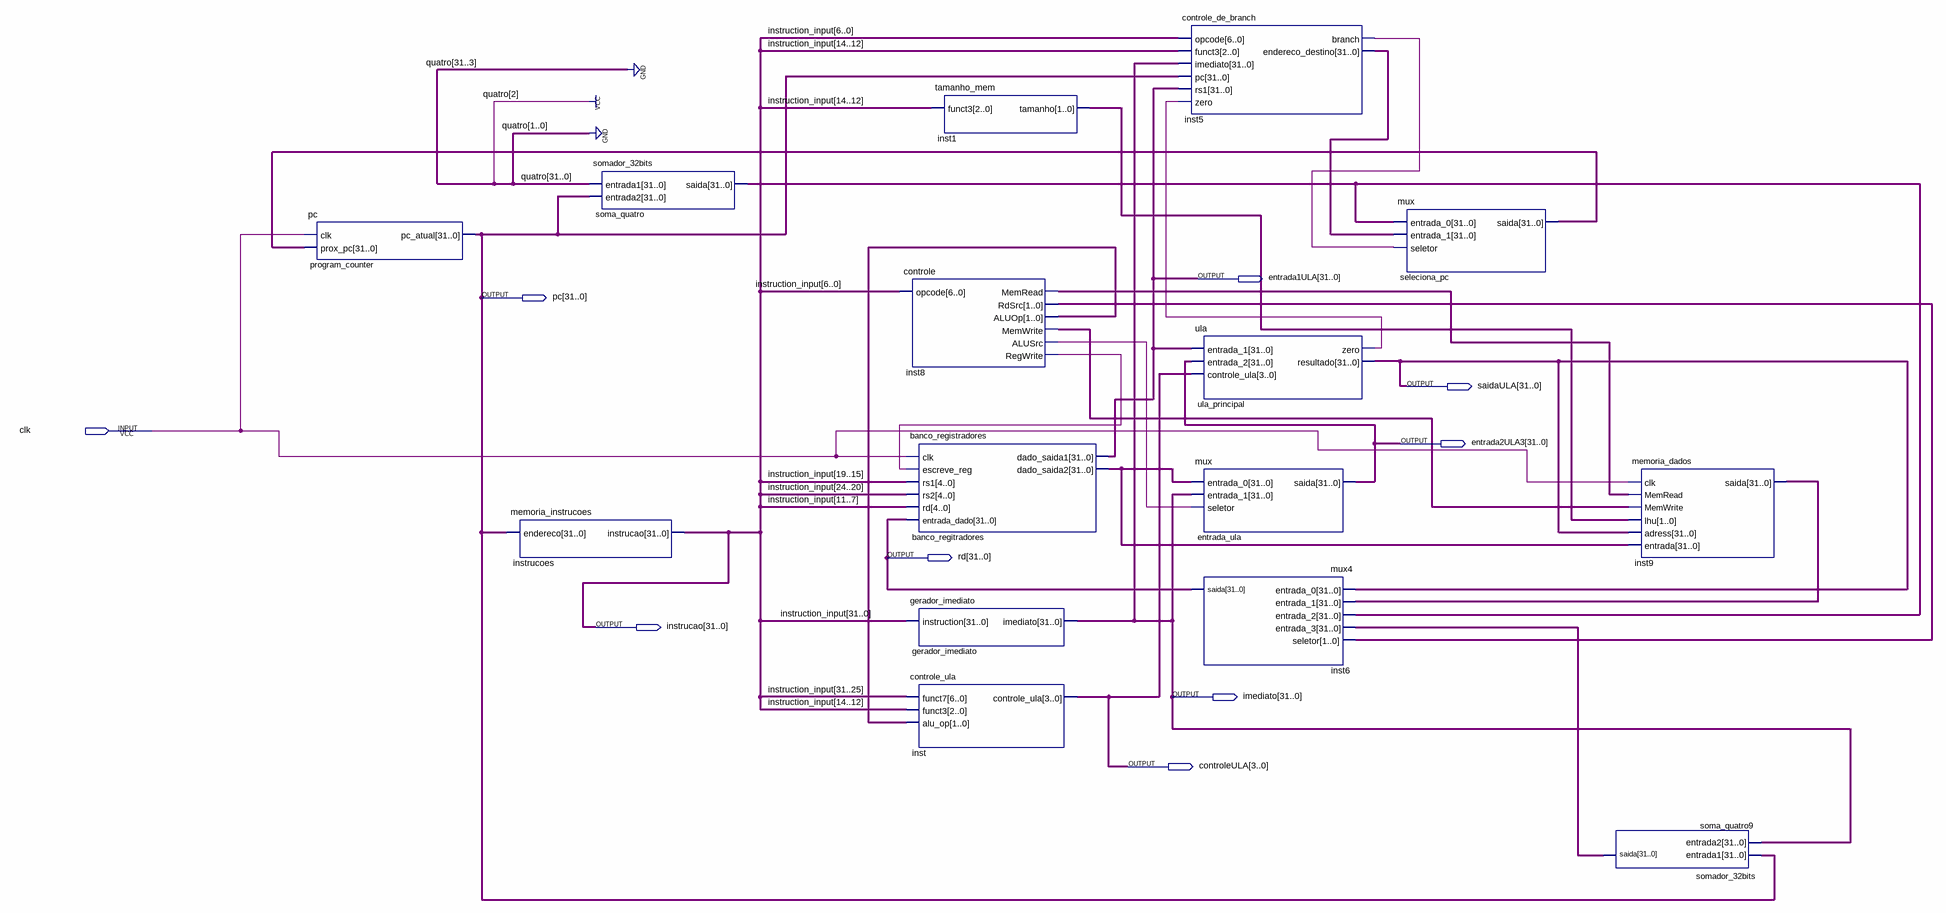
[diagram p0: schematic sheet]
// Quartus schematic lab2oac.bdf as structural Verilog: 15 symbols, 9 pins
module lab2oac (
  input  clk,
  output [31:0] entrada1ULA,
  output [31:0] pc,
  output [31:0] saidaULA,
  output [31:0] entrada2ULA3,
  output [31:0] rd,
  output [31:0] instrucao,
  output [31:0] imediato,
  output [3:0] controleULA
);

  wire inst5_branch, inst8_alusrc, inst8_memread, inst8_memwrite, inst8_regwrite, ula_principal_zero;
  wire [1:0] inst1_tamanho, inst8_aluop, inst8_rdsrc;
  wire [31:0] banco_regitradores_dado_saida2, inst5_endereco_destino, inst9_saida, seleciona_pc_saida,
       soma_quatro9_saida, soma_quatro_saida;

  pc program_counter (.clk(clk), .prox_pc(seleciona_pc_saida), .pc_atual(pc));
  memoria_instrucoes instrucoes (.endereco(pc), .instrucao(instrucao));
  somador_32bits soma_quatro (
    .entrada1(32'b00000000000000000000000000000100), .entrada2(pc), .saida(soma_quatro_saida));
  controle inst8 (
    .opcode(instrucao[6:0]), .MemRead(inst8_memread), .RdSrc(inst8_rdsrc), .ALUOp(inst8_aluop),
    .MemWrite(inst8_memwrite), .ALUSrc(inst8_alusrc), .RegWrite(inst8_regwrite));
  banco_registradores banco_regitradores (
    .clk(clk), .escreve_reg(inst8_regwrite), .rs1(instrucao[19:15]), .rs2(instrucao[24:20]),
    .rd(instrucao[11:7]), .entrada_dado(rd), .dado_saida1(entrada1ULA),
    .dado_saida2(banco_regitradores_dado_saida2));
  gerador_imediato gerador_imediato (.instruction(instrucao), .imediato(imediato));
  controle_ula inst (
    .funct7(instrucao[31:25]), .funct3(instrucao[14:12]), .alu_op(inst8_aluop), .controle_ula(controleULA));
  tamanho_mem inst1 (.funct3(instrucao[14:12]), .tamanho(inst1_tamanho));
  controle_de_branch inst5 (
    .opcode(instrucao[6:0]), .funct3(instrucao[14:12]), .imediato(imediato), .pc(pc), .rs1(entrada1ULA),
    .zero(ula_principal_zero), .branch(inst5_branch), .endereco_destino(inst5_endereco_destino));
  ula ula_principal (
    .entrada_1(entrada1ULA), .entrada_2(entrada2ULA3), .controle_ula(controleULA), .zero(ula_principal_zero),
    .resultado(saidaULA));
  mux entrada_ula (
    .entrada_0(banco_regitradores_dado_saida2), .entrada_1(imediato), .seletor(inst8_alusrc),
    .saida(entrada2ULA3));
  mux4 inst6 (
    .entrada_0(saidaULA), .entrada_1(inst9_saida), .entrada_2(soma_quatro_saida),
    .entrada_3(soma_quatro9_saida), .seletor(inst8_rdsrc), .saida(rd));
  mux seleciona_pc (
    .entrada_0(soma_quatro_saida), .entrada_1(inst5_endereco_destino), .seletor(inst5_branch),
    .saida(seleciona_pc_saida));
  memoria_dados inst9 (
    .clk(clk), .MemRead(inst8_memread), .MemWrite(inst8_memwrite), .lhu(inst1_tamanho), .adress(saidaULA),
    .entrada(banco_regitradores_dado_saida2), .saida(inst9_saida));
  somador_32bits soma_quatro9 (.entrada1(pc), .entrada2(imediato), .saida(soma_quatro9_saida));

  // Other names for the same wires on the sheet: instruction_input[31:0] = instrucao
endmodule
